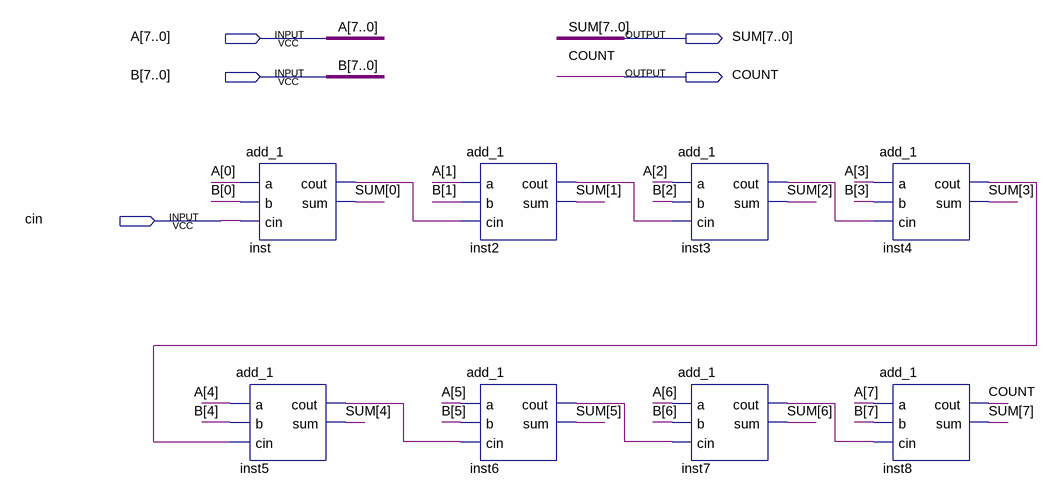
[diagram p0: schematic sheet]
// Quartus schematic add_8.bdf as structural Verilog: 8 symbols, 5 pins
module add_8 (
  input  [7:0] A,
  input  [7:0] B,
  input  cin,
  output [7:0] SUM,
  output COUNT
);

  wire inst2_cout, inst3_cout, inst4_cout, inst5_cout, inst6_cout, inst7_cout, inst_cout;

  add_1 inst (.a(A[0]), .b(B[0]), .cin(cin), .cout(inst_cout), .sum(SUM[0]));
  add_1 inst5 (.a(A[4]), .b(B[4]), .cin(inst4_cout), .cout(inst5_cout), .sum(SUM[4]));
  add_1 inst2 (.a(A[1]), .b(B[1]), .cin(inst_cout), .cout(inst2_cout), .sum(SUM[1]));
  add_1 inst6 (.a(A[5]), .b(B[5]), .cin(inst5_cout), .cout(inst6_cout), .sum(SUM[5]));
  add_1 inst3 (.a(A[2]), .b(B[2]), .cin(inst2_cout), .cout(inst3_cout), .sum(SUM[2]));
  add_1 inst7 (.a(A[6]), .b(B[6]), .cin(inst6_cout), .cout(inst7_cout), .sum(SUM[6]));
  add_1 inst4 (.a(A[3]), .b(B[3]), .cin(inst3_cout), .cout(inst4_cout), .sum(SUM[3]));
  add_1 inst8 (.a(A[7]), .b(B[7]), .cin(inst7_cout), .cout(COUNT), .sum(SUM[7]));
endmodule
